# Altium schematic sheet МПСУ.464421.22-01 BBP.SchDoc
size 420 x 297 mm; Author: Лазба Ф.Б.; CompanyName: МИЭТ; DrawnBy: Лазба Ф.Б.; Organization: МИЭТ; Address1: Address1; Address2: Address2; Address3: Address3; Address4: Address4; SheetNumber: 1; SheetTotal: 6; DocumentTypeSCH: Э3; NachOtdelaSCH: Орешкин; DocumentName1SCH: Плата; UtverjdenSCH: Утвержден
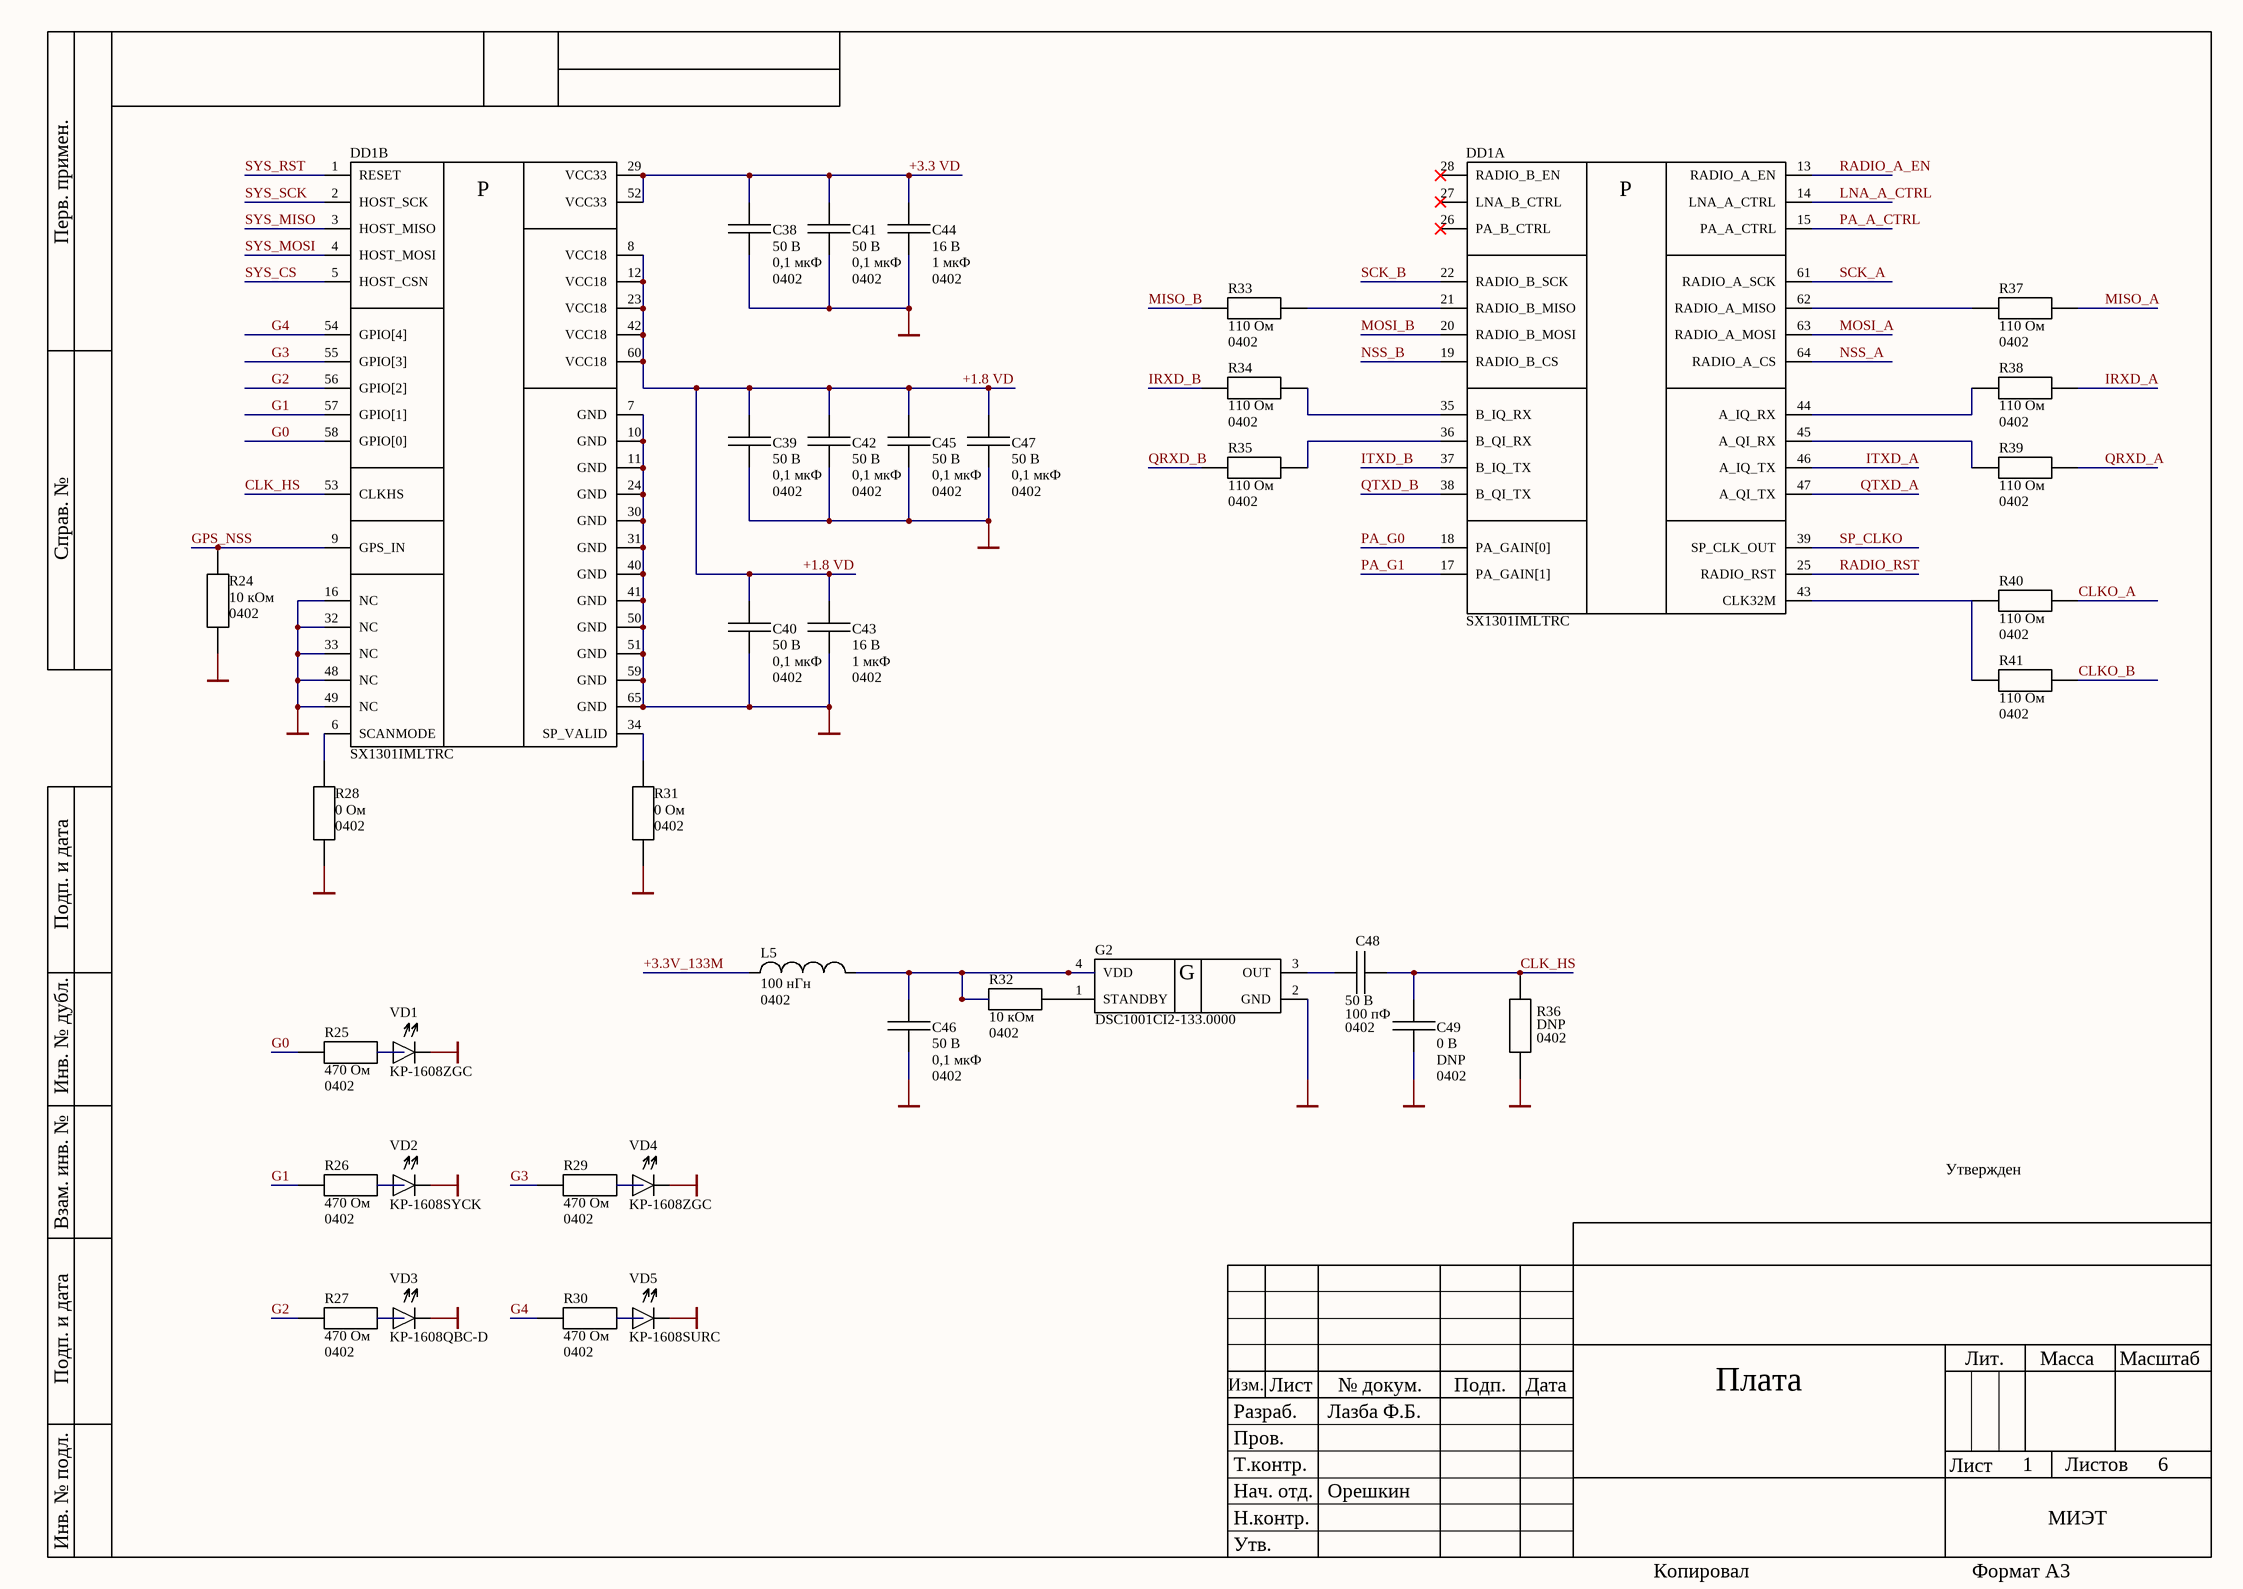
[diagram p0: МПСУ.464421.22-01 BBP.SchDoc]

## Parts
C38  value 0,1 мкФ  Peak_Condition: 50 В  Package: 0402  [CAPC100X50X55L20N]  (hidden comment: 0,1 мкФ ± 10 % 50 В X7R 0402 GRM155R71H104KE14J)
C39  value 0,1 мкФ  Peak_Condition: 50 В  Package: 0402  [CAPC100X50X55L20N]  (hidden comment: 0,1 мкФ ± 10 % 50 В X7R 0402 GRM155R71H104KE14J)
C40  value 0,1 мкФ  Peak_Condition: 50 В  Package: 0402  [CAPC100X50X55L20N]  (hidden comment: 0,1 мкФ ± 10 % 50 В X7R 0402 GRM155R71H104KE14J)
C41  value 0,1 мкФ  Peak_Condition: 50 В  Package: 0402  [CAPC100X50X55L20N]  (hidden comment: 0,1 мкФ ± 10 % 50 В X7R 0402 GRM155R71H104KE14J)
C42  value 0,1 мкФ  Peak_Condition: 50 В  Package: 0402  [CAPC100X50X55L20N]  (hidden comment: 0,1 мкФ ± 10 % 50 В X7R 0402 GRM155R71H104KE14J)
C43  value 1 мкФ  Peak_Condition: 16 В  Package: 0402  [CAPC100X50X55L20N]  (hidden comment: 1 мкФ ± 10 % 16 В X5R 0402 GRM155R61C105KA12D)
C44  value 1 мкФ  Peak_Condition: 16 В  Package: 0402  [CAPC100X50X55L20N]  (hidden comment: 1 мкФ ± 10 % 16 В X5R 0402 GRM155R61C105KA12D)
C45  value 0,1 мкФ  Peak_Condition: 50 В  Package: 0402  [CAPC100X50X55L20N]  (hidden comment: 0,1 мкФ ± 10 % 50 В X7R 0402 GRM155R71H104KE14J)
C46  value 0,1 мкФ  Peak_Condition: 50 В  Package: 0402  [CAPC100X50X55L20N]  (hidden comment: 0,1 мкФ ± 10 % 50 В X7R 0402 GRM155R71H104KE14J)
C47  value 0,1 мкФ  Peak_Condition: 50 В  Package: 0402  [CAPC100X50X55L20N]  (hidden comment: 0,1 мкФ ± 10 % 50 В X7R 0402 GRM155R71H104KE14J)
C48  value 100 пФ  Peak_Condition: 50 В  Package: 0402  [CAPC100X50X55L20N]  (hidden comment: 100 пФ ± 5 % 50 В C0G 0402 GRM1555C1H101JZ01D)
C49  value DNP  Peak_Condition: 0 В  Package: 0402  [CAPC100X50X55L20N]  (hidden comment: DNP 0402)
DD1  SX1301IMLTRC  [SX1301IMLTRC]  (parts A,B of 2)
G2  DSC1001CI2-133.0000  [DSC1001CI2]
L5  value 100 нГн  Package: 0402  [INDC100X50X60L10N]  (hidden comment: 100 нГн ± 5 % 200 мА 0402 LQG15HNR10J02D)
R24  value 10 кОм  Package: 0402  [RESC100X50X40L25N]  (hidden comment: 10 кОм ± 5 % 0 Вт 0402 RI0402L103JT)
R25  value 470 Ом  Package: 0402  [RESC100X50X40L25N]  (hidden comment: 470 Ом ± 5 % 0 Вт 0402 RI0402L471JT)
R26  value 470 Ом  Package: 0402  [RESC100X50X40L25N]  (hidden comment: 470 Ом ± 5 % 0 Вт 0402 RI0402L471JT)
R27  value 470 Ом  Package: 0402  [RESC100X50X40L25N]  (hidden comment: 470 Ом ± 5 % 0 Вт 0402 RI0402L471JT)
R28  value 0 Ом  Package: 0402  [RESC100X50X40L25N]  (hidden comment: 0 Ом ± 5 % 0 Вт 0402 RI0402L000JT)
R29  value 470 Ом  Package: 0402  [RESC100X50X40L25N]  (hidden comment: 470 Ом ± 5 % 0 Вт 0402 RI0402L471JT)
R30  value 470 Ом  Package: 0402  [RESC100X50X40L25N]  (hidden comment: 470 Ом ± 5 % 0 Вт 0402 RI0402L471JT)
R31  value 0 Ом  Package: 0402  [RESC100X50X40L25N]  (hidden comment: 0 Ом ± 5 % 0 Вт 0402 RI0402L000JT)
R32  value 10 кОм  Package: 0402  [RESC100X50X40L25N]  (hidden comment: 10 кОм ± 5 % 0 Вт 0402 RI0402L103JT)
R33  value 110 Ом  Package: 0402  [RESC100X50X40L25N]  (hidden comment: 110 Ом ± 5 % 0 Вт 0402 RC-02U111JT)
R34  value 110 Ом  Package: 0402  [RESC100X50X40L25N]  (hidden comment: 110 Ом ± 5 % 0 Вт 0402 RC-02U111JT)
R35  value 110 Ом  Package: 0402  [RESC100X50X40L25N]  (hidden comment: 110 Ом ± 5 % 0 Вт 0402 RC-02U111JT)
R36  value DNP  Package: 0402  [RESC100X50X40L25N]  (hidden comment: DNP 0402)
R37  value 110 Ом  Package: 0402  [RESC100X50X40L25N]  (hidden comment: 110 Ом ± 5 % 0 Вт 0402 RC-02U111JT)
R38  value 110 Ом  Package: 0402  [RESC100X50X40L25N]  (hidden comment: 110 Ом ± 5 % 0 Вт 0402 RC-02U111JT)
R39  value 110 Ом  Package: 0402  [RESC100X50X40L25N]  (hidden comment: 110 Ом ± 5 % 0 Вт 0402 RC-02U111JT)
R40  value 110 Ом  Package: 0402  [RESC100X50X40L25N]  (hidden comment: 110 Ом ± 5 % 0 Вт 0402 RC-02U111JT)
R41  value 110 Ом  Package: 0402  [RESC100X50X40L25N]  (hidden comment: 110 Ом ± 5 % 0 Вт 0402 RC-02U111JT)
VD1  KP-1608ZGC  [KP-1608ZGC]
VD2  KP-1608SYCK  [KP-1608ZGC]
VD3  KP-1608QBC-D  [KP-1608ZGC]
VD4  KP-1608ZGC  [KP-1608ZGC]
VD5  KP-1608SURC  [KP-1608ZGC]

## Nets
GND: C38.2 C39.2 C40.2 C41.2 C42.2 C43.2 C44.2 C45.2 C46.2 C47.2 C49.2 DD1.7(GND) DD1.10(GND) DD1.11(GND) DD1.16(NC) DD1.24(GND) DD1.30(GND) DD1.31(GND) DD1.32(NC) DD1.33(NC) DD1.40(GND) DD1.41(GND) DD1.48(NC) DD1.49(NC) DD1.50(GND) DD1.51(GND) DD1.59(GND) DD1.65(GND) G2.2(GND) R24.1 R28.1 R31.1 R36.2 VD1.2 VD2.2 VD3.2 VD4.2 VD5.2
+1.8 VD: C39.1 C40.1 C42.1 C43.1 C45.1 C47.1 DD1.8(VCC18) DD1.12(VCC18) DD1.23(VCC18) DD1.42(VCC18) DD1.60(VCC18)
+3.3 VD: C38.1 C41.1 C44.1 DD1.29(VCC33) DD1.52(VCC33)
+3.3V_133M: L5.1
CLK_HS: C48.2 C49.1 DD1.53(CLKHS) R36.1
CLKO_A: R40.2
CLKO_B: R41.2
G0: DD1.58(GPIO[0]) R25.1
G1: DD1.57(GPIO[1]) R26.1
G2: DD1.56(GPIO[2]) R27.1
G3: DD1.55(GPIO[3]) R29.1
G4: DD1.54(GPIO[4]) R30.1
GPS_NSS: DD1.9(GPS_IN) R24.2
IRXD_A: R38.2
IRXD_B: R34.1
ITXD_A: DD1.46(A_IQ_TX)
ITXD_B: DD1.37(B_IQ_TX)
LNA_A_CTRL: DD1.14(LNA_A_CTRL)
MISO_A: R37.2
MISO_B: R33.1
MOSI_A: DD1.63(RADIO_A_MOSI)
MOSI_B: DD1.20(RADIO_B_MOSI)
NSS_A: DD1.64(RADIO_A_CS)
NSS_B: DD1.19(RADIO_B_CS)
PA_A_CTRL: DD1.15(PA_A_CTRL)
PA_G0: DD1.18(PA_GAIN[0])
PA_G1: DD1.17(PA_GAIN[1])
QRXD_A: R39.2
QRXD_B: R35.1
QTXD_A: DD1.47(A_QI_TX)
QTXD_B: DD1.38(B_QI_TX)
RADIO_A_EN: DD1.13(RADIO_A_EN)
RADIO_RST: DD1.25(RADIO_RST)
SCK_A: DD1.61(RADIO_A_SCK)
SCK_B: DD1.22(RADIO_B_SCK)
SP_CLKO: DD1.39(SP_CLK_OUT)
SYS_CS: DD1.5(HOST_CSN)
SYS_MISO: DD1.3(HOST_MISO)
SYS_MOSI: DD1.4(HOST_MOSI)
SYS_RST: DD1.1(RESET)
SYS_SCK: DD1.2(HOST_SCK)
NetC46_1: C46.1 G2.4(VDD) L5.2 R32.1
NetC48_1: C48.1 G2.3(OUT)
NetDD1_6: DD1.6(SCANMODE) R28.2
NetDD1_21: DD1.21(RADIO_B_MISO) R33.2
NetDD1_34: DD1.34(SP_VALID) R31.2
NetDD1_35: DD1.35(B_IQ_RX) R34.2
NetDD1_36: DD1.36(B_QI_RX) R35.2
NetDD1_43: DD1.43(CLK32M) R40.1 R41.1
NetDD1_44: DD1.44(A_IQ_RX) R38.1
NetDD1_45: DD1.45(A_QI_RX) R39.1
NetDD1_62: DD1.62(RADIO_A_MISO) R37.1
NetG2_1: G2.1(STANDBY) R32.2
NetR25_2: R25.2 VD1.1
NetR26_2: R26.2 VD2.1
NetR27_2: R27.2 VD3.1
NetR29_2: R29.2 VD4.1
NetR30_2: R30.2 VD5.1

Not connected (* = marked no-connect by the designer): DD1 26(PA_B_CTRL)* 27(LNA_B_CTRL)* 28(RADIO_B_EN)*

## Notes on the sheet
- Перв. примен.
- Справ. №
- Подп. и дата
- Инв. № дубл.
- Взам. инв. №
- Разраб.
- Изм.
- Лист
- № докум.
- Подп.
- Дата
- Лит.
- Масса
- Масштаб
- Пров.
- Т.контр.
- Листов
- Инв. № подл.
- Утв.
- Н.контр.
- Нач. отд.
- Копировал
- Формат А3
- (in symbol DSC1001/3/4***-***.****) G
- (in symbol SX1301IMLTRC, part A) P
- (in symbol SX1301IMLTRC, part B) P

## Library data of the parts
C38-C47 = C 0402: Capacitor 0402; Manufacturer: Murata; Tolerance: 10 %; Designer: Свидерский; 3D_Body: +; Category: Passive; Subcategory: Capacitor; Status: Approved
  C38-C42 C45-C47: PartNumber: GRM155R71H104KE14J; Dielectric: X7R
  C43 C44: PartNumber: GRM155R61C105KA12D; Dielectric: X5R
C48 = C 0402: Capacitor 0402; Manufacturer: Murata; Tolerance: 5 %; Designer: Свидерский; 3D_Body: +; PartNumber: GRM1555C1H101JZ01D; Category: Passive; Subcategory: Capacitor; Dielectric: C0G; Status: Approved
C49 = C 0402: Capacitor 0402; Tolerance: 0 %; Designer: Свидерский; Notes: CP; 3D_Body: +; Category: Passive; Subcategory: Capacitor; Status: Approved
DD1 = SX1301IMLTRC: LoRa Core™ Digital Baseband Chip for outdoor LoRaWAN® network macro gateways; Manufacturer: Semtech; Designer: Лазба; 3D_Body: +; ComponentLink1Description: Техническое описание; ComponentLink1URL: Q:\Libs\Descriptions_PDF\DS_SX1301_V2_4_W.pdf; Category: IC; Subcategory: BPP; Status: Check; Package: QFN64; PartNumber: SX1301IMLTRC
G2 = DSC1001/3/4***-***.****: 1.8V-3.3V Low-Power Precision CMOS Oscillators 1-150 MHz Family; Manufacturer: Microchip; Designer: Лазба; 3D_Body: +; ComponentLink1Description: Техническое описание; ComponentLink1URL: Q:\Libs\Descriptions_PDF\DSC1001-3-4\DSC1001-3-4.pdf; Category: IC; Subcategory: Crystal Oscillator; Status: Check; Package: *; ComponentLink2Description: Техническое описание 2; ComponentLink2URL: Q:\Libs\Descriptions_PDF\DSC1001-3-4\DSC1001.pdf; PartNumber: DSC1001CI2-133.0000
L5 = L 0402: Inductor 0402; Manufacturer: Murata; Designer: Свидерский; 3D_Body: +; Tolerance: 5 %; Peak_Condition: 200 мА; PartNumber: LQG15HNR10J02D; Category: Passive; Subcategory: Inductor; Status: Approved
R24-R32 = R 0402: Resistor 0402; Manufacturer: Hottech; Designer: Свидерский; 3D_Body: +; Tolerance: 5 %; Peak_Condition: 0 Вт; Category: Passive; Subcategory: Resistor; Status: Approved
  R24 R32: PartNumber: RI0402L103JT
  R25-R27 R29 R30: PartNumber: RI0402L471JT
  R28 R31: PartNumber: RI0402L000JT
R33-R35 R37-R41 = R 0402: Resistor 0402; Manufacturer: Fenghua; Designer: Свидерский; 3D_Body: +; Tolerance: 5 %; Peak_Condition: 0 Вт; PartNumber: RC-02U111JT; Category: Passive; Subcategory: Resistor; Status: Approved
R36 = R 0402: Resistor 0402; Designer: Свидерский; Notes: CP; 3D_Body: +; Tolerance: 0 %; Peak_Condition: 0 Вт; Category: Passive; Subcategory: Resistor; Status: Approved
VD1-VD5 = KP-1608***: 1.6X0.8mm SMD CHIP LED LAMP; Manufacturer: Kingbright; 3D_Body: +; Designer: Ушакова; Category: Discrete; ComponentLink1Description: Техническое описание; ComponentLink1URL: Q:\Libs\Descriptions_PDF\KP-1608ZGC.pdf; Package: 1.6mmX0.8mm SMD LED; Status: Approved; Subcategory: Diode
  VD1 VD4: PartNumber: KP-1608ZGC
  VD2: PartNumber: KP-1608SYCK
  VD3: PartNumber: KP-1608QBC-D
  VD5: PartNumber: KP-1608SURC